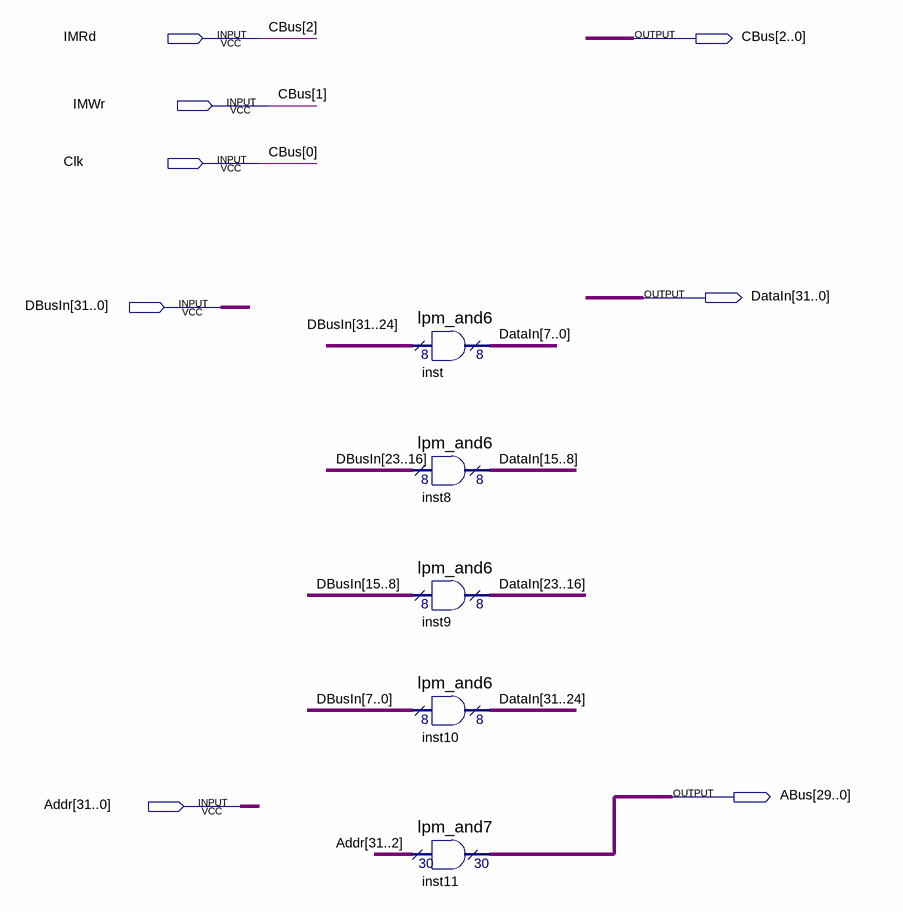
[diagram p0: schematic sheet]
// Quartus schematic IBIU.bdf as structural Verilog: 5 symbols, 8 pins
module IBIU (
  input  IMRd,
  input  IMWr,
  input  Clk,
  input  [31:0] DBusIn,
  input  [31:0] Addr,
  output [2:0] CBus,
  output [31:0] DataIn,
  output [29:0] ABus
);

  lpm_and6 inst (.data0x(DBusIn[31:24]), .result(DataIn[7:0]));
  lpm_and6 inst8 (.data0x(DBusIn[23:16]), .result(DataIn[15:8]));
  lpm_and6 inst9 (.data0x(DBusIn[15:8]), .result(DataIn[23:16]));
  lpm_and6 inst10 (.data0x(DBusIn[7:0]), .result(DataIn[31:24]));
  lpm_and7 inst11 (.data0x(Addr[31:2]), .result(ABus));

  assign CBus = {IMRd, IMWr, Clk};
endmodule
